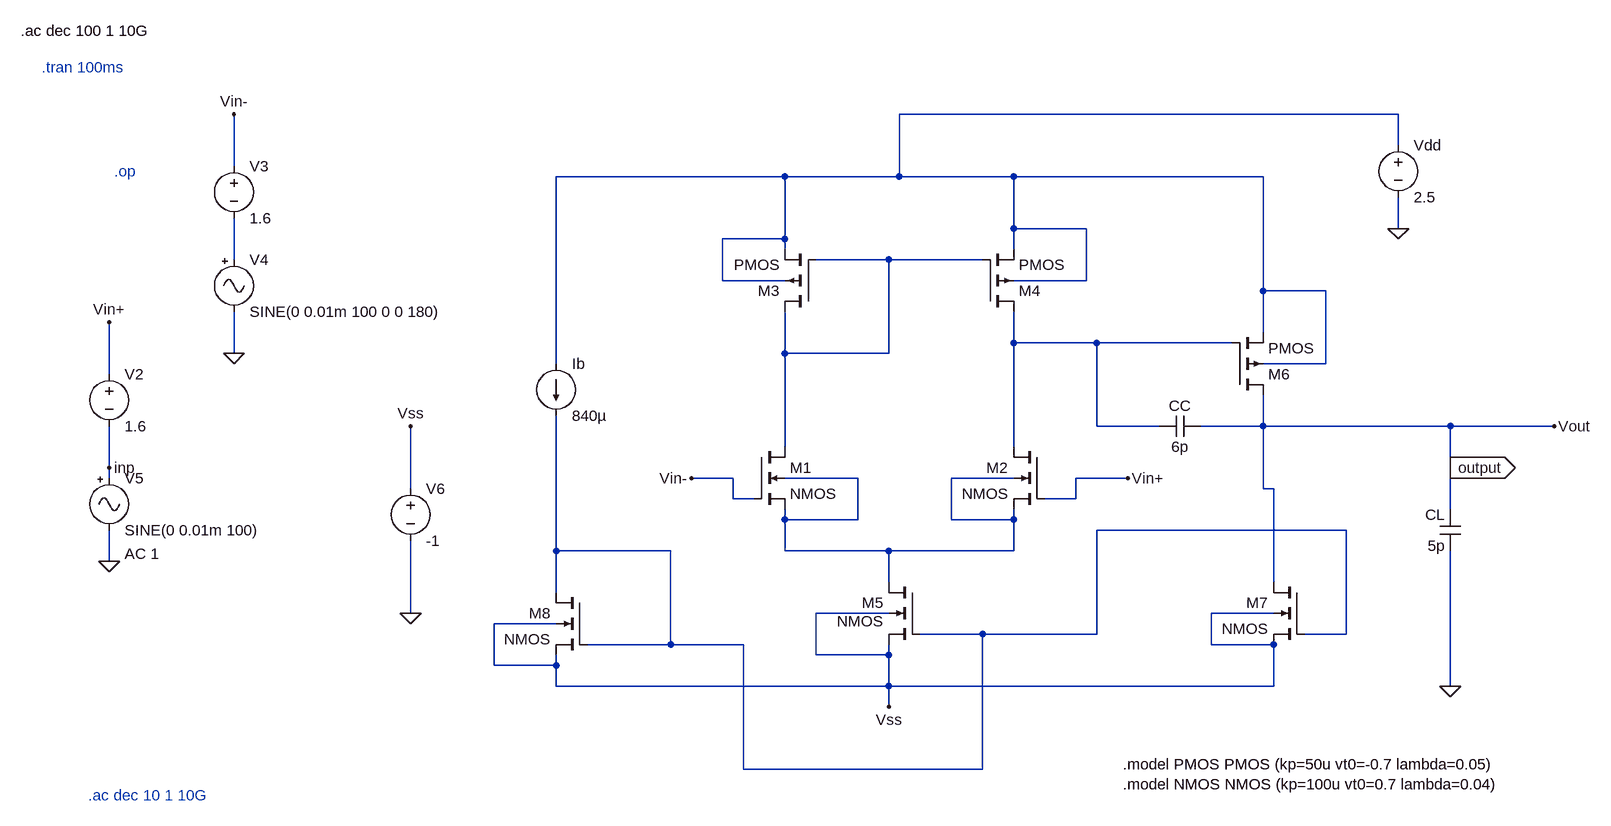
[diagram p0: schematic commnet_ps1_kaiser.asc]
commnet_ps1_kaiser.asc, the LTspice schematic file:
Version 4
SHEET 1 1224 984
WIRE 912 -112 144 -112
WIRE 912 -64 912 -112
WIRE -880 -32 -880 -112
WIRE -32 -16 -384 -16
WIRE 144 -16 144 -112
WIRE 144 -16 -32 -16
WIRE 320 -16 144 -16
WIRE 704 -16 320 -16
WIRE 320 64 320 -16
WIRE 432 64 320 64
WIRE 912 64 912 16
WIRE -32 80 -32 -16
WIRE -32 80 -128 80
WIRE -32 96 -32 80
WIRE 320 96 320 64
WIRE -880 112 -880 48
WIRE 128 112 16 112
WIRE 272 112 128 112
WIRE -128 144 -128 80
WIRE -32 144 -128 144
WIRE 432 144 432 64
WIRE 432 144 320 144
WIRE 704 160 704 -16
WIRE 800 160 704 160
WIRE 704 224 704 160
WIRE 320 240 320 192
WIRE 448 240 320 240
WIRE 656 240 448 240
WIRE -880 256 -880 192
WIRE -32 256 -32 192
WIRE 128 256 128 112
WIRE 128 256 -32 256
WIRE -384 272 -384 -16
WIRE 800 272 800 160
WIRE 800 272 704 272
WIRE -1072 288 -1072 208
WIRE 448 368 448 240
WIRE 544 368 448 368
WIRE 704 368 704 320
WIRE 704 368 608 368
WIRE 992 368 704 368
WIRE 1152 368 992 368
WIRE -32 400 -32 256
WIRE 320 400 320 240
WIRE -1072 432 -1072 368
WIRE 992 432 992 368
WIRE -1072 448 -1072 432
WIRE -112 448 -176 448
WIRE 80 448 -32 448
WIRE 320 448 224 448
WIRE 496 448 416 448
WIRE -608 464 -608 368
WIRE 704 464 704 368
WIRE 720 464 704 464
WIRE -112 480 -112 448
WIRE -80 480 -112 480
WIRE 416 480 416 448
WIRE 416 480 368 480
WIRE 992 496 992 432
WIRE -32 512 -32 496
WIRE 80 512 80 448
WIRE 80 512 -32 512
WIRE 224 512 224 448
WIRE 320 512 320 496
WIRE 320 512 224 512
WIRE 832 528 448 528
WIRE -384 560 -384 352
WIRE -208 560 -384 560
WIRE -32 560 -32 512
WIRE 128 560 -32 560
WIRE 320 560 320 512
WIRE 320 560 128 560
WIRE -1072 576 -1072 528
WIRE 128 608 128 560
WIRE 720 608 720 464
WIRE -384 624 -384 560
WIRE -608 656 -608 544
WIRE 128 656 16 656
WIRE 720 656 624 656
WIRE -384 672 -480 672
WIRE 272 688 176 688
WIRE 448 688 448 528
WIRE 448 688 272 688
WIRE 832 688 832 528
WIRE 832 688 768 688
WIRE -208 704 -208 560
WIRE -208 704 -336 704
WIRE -96 704 -208 704
WIRE 624 704 624 656
WIRE 720 704 624 704
WIRE 16 720 16 656
WIRE 128 720 128 704
WIRE 128 720 16 720
WIRE -480 736 -480 672
WIRE -384 736 -384 720
WIRE -384 736 -480 736
WIRE -384 768 -384 736
WIRE 128 768 128 720
WIRE 128 768 -384 768
WIRE 720 768 720 704
WIRE 720 768 128 768
WIRE 992 768 992 560
WIRE 128 800 128 768
WIRE -96 896 -96 704
WIRE 272 896 272 688
WIRE 272 896 -96 896
FLAG 992 768 0
FLAG 912 64 0
FLAG -1072 576 0
FLAG -880 256 0
FLAG 1152 368 Vout
FLAG -880 -112 Vin-
FLAG -176 448 Vin-
FLAG -1072 208 Vin+
FLAG 496 448 Vin+
FLAG -608 656 0
FLAG -608 368 Vss
FLAG 128 800 Vss
FLAG -1072 432 inp
FLAG 992 432 output
IOPIN 992 432 Out
DATAFLAG 976 384 ""
SYMBOL current -384 272 R0
WINDOW 123 0 0 Left 0
WINDOW 39 0 0 Left 0
SYMATTR InstName Ib
SYMATTR Value 840µ
SYMBOL cap 608 352 R90
WINDOW 0 0 32 VBottom 2
WINDOW 3 32 32 VTop 2
SYMATTR InstName CC
SYMATTR Value 6p
SYMBOL cap 1008 560 R180
WINDOW 0 24 56 Left 2
WINDOW 3 24 8 Left 2
SYMATTR InstName CL
SYMATTR Value 5p
SYMBOL voltage 912 -80 R0
WINDOW 123 0 0 Left 0
WINDOW 39 0 0 Left 0
SYMATTR InstName Vdd
SYMATTR Value 2.5
SYMBOL voltage -1072 272 R0
WINDOW 123 0 0 Left 0
WINDOW 39 0 0 Left 0
SYMATTR InstName V2
SYMATTR Value 1.6
SYMBOL voltage -880 -48 R0
WINDOW 123 0 0 Left 0
WINDOW 39 0 0 Left 0
SYMATTR InstName V3
SYMATTR Value 1.6
SYMBOL signal -880 96 R0
WINDOW 123 24 132 Left 2
WINDOW 39 0 0 Left 0
SYMATTR InstName V4
SYMATTR Value SINE(0 0.01m 100 0 0 180)
SYMBOL signal -1072 432 R0
WINDOW 123 24 132 Left 2
WINDOW 39 0 0 Left 0
SYMATTR Value2 AC 1
SYMATTR InstName V5
SYMATTR Value SINE(0 0.01m 100)
SYMBOL nmos4 -80 400 R0
SYMATTR InstName M1
SYMATTR Value2 l=1u w=42.3u
SYMBOL nmos4 368 400 M0
SYMATTR InstName M2
SYMATTR Value2 l=1u w=42.3u
SYMBOL nmos4 176 608 M0
WINDOW 3 56 60 Left 2
SYMATTR InstName M5
SYMATTR Value2 l=1u w=102.74u
SYMBOL nmos4 -336 624 M0
SYMATTR InstName M8
SYMATTR Value2 l=1u w=102.74u
SYMBOL nmos4 768 608 M0
SYMATTR InstName M7
SYMATTR Value2 l=1u w=691.68u
SYMBOL pmos4 272 192 M180
SYMATTR InstName M4
SYMATTR Value2 l=1u w=46.67u
SYMBOL pmos4 656 320 M180
SYMATTR InstName M6
SYMATTR Value2 l=1u w=628.32u
SYMBOL pmos4 16 192 R180
SYMATTR InstName M3
SYMATTR Value2 l=1u w=46.67u
SYMBOL voltage -608 448 R0
WINDOW 123 0 0 Left 0
WINDOW 39 0 0 Left 0
SYMATTR InstName V6
SYMATTR Value -1
TEXT 488 888 Left 2 !.model PMOS PMOS (kp=50u vt0=-0.7 lambda=0.05)\n.model NMOS NMOS (kp=100u vt0=0.7 lambda=0.04)
TEXT -1104 936 Left 2 ;.ac dec 10 1 10G
TEXT -1208 -240 Left 2 !.ac dec 100 1 10G
TEXT -1176 -184 Left 2 ;.tran 100ms
TEXT -1064 -24 Left 2 ;.op

The netlist it stands for:
* commnet_ps1_kaiser.asc
Ib N001 N006 840µ
CC output N004 6p
CL 0 output 5p
Vdd N001 0 2.5
V2 Vin+ inp 1.6
V3 Vin- N002 1.6
V4 N002 0 SINE(0 0.01m 100 0 0 180)
V5 inp 0 SINE(0 0.01m 100) AC 1
M1 N003 Vin- N005 N005 NMOS l=1u w=42.3u
M2 N004 Vin+ N005 N005 NMOS l=1u w=42.3u
M5 N005 N006 Vss Vss NMOS l=1u w=102.74u
M8 N006 N006 Vss Vss NMOS l=1u w=102.74u
M7 output N006 Vss Vss NMOS l=1u w=691.68u
M4 N004 N003 N001 N001 PMOS l=1u w=46.67u
M6 output N004 N001 N001 PMOS l=1u w=628.32u
M3 N003 N003 N001 N001 PMOS l=1u w=46.67u
V6 Vss 0 -1
.model NMOS NMOS
.model PMOS PMOS
.lib standard.mos
.model PMOS PMOS (kp=50u vt0=-0.7 lambda=0.05)
.model NMOS NMOS (kp=100u vt0=0.7 lambda=0.04)
* .ac dec 10 1 10G
.ac dec 100 1 10G
* .tran 100ms
* .op
.backanno
.end